# Altium project StarKit V1.0.PrjPcb
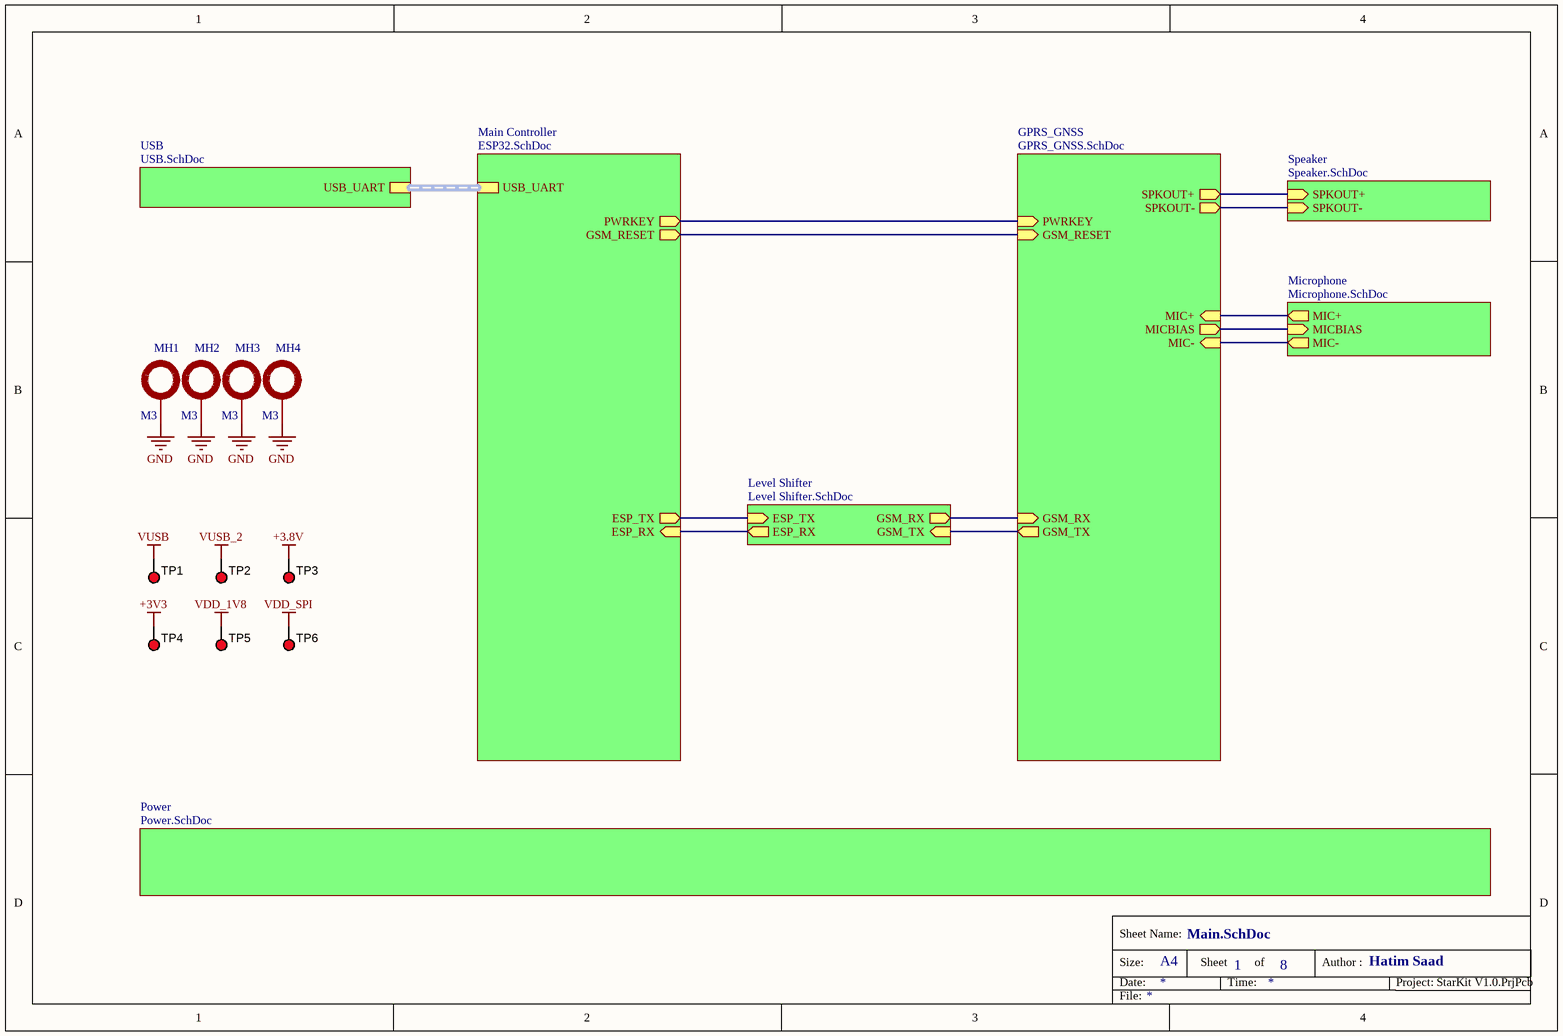
[diagram p0: Main.SchDoc]
8 sheets, 155 parts. Net scope: hierarchical (ports join the sheet entries above them; power ports are global).
Board file: StarKit PCB.PcbDoc
Sheets:
  Main.SchDoc
    Main Controller = ESP32.SchDoc
    Microphone = Microphone.SchDoc
    USB = USB.SchDoc
    GPRS_GNSS = GPRS_GNSS.SchDoc
    Speaker = Speaker.SchDoc
    Power = Power.SchDoc
    Level Shifter = Level Shifter.SchDoc

## Sheet Main.SchDoc
size A4; DocumentNumber: 1; SheetNumber: 1; SheetTotal: 8

### Parts
MH1  M3  [M3 Mounting Hole]
MH2  M3  [M3 Mounting Hole]
MH3  M3  [M3 Mounting Hole]
MH4  M3  [M3 Mounting Hole]
TP1  5010  [test point]  (value not drawn)  (no BOM)
TP2  5010  [test point]  (value not drawn)  (no BOM)
TP3  5010  [test point]  (value not drawn)  (no BOM)
TP4  5010  [test point]  (value not drawn)  (no BOM)
TP5  5010  [test point]  (value not drawn)  (no BOM)
TP6  5010  [test point]  (value not drawn)  (no BOM)

### Sub-sheets
GPRS_GNSS = GPRS_GNSS.SchDoc: PWRKEY (in), GSM_TX (out), GSM_RESET (in), GSM_RX (in), SPKOUT+ (out), SPKOUT- (out), MIC+ (in), MICBIAS (out), MIC- (in)
Level Shifter = Level Shifter.SchDoc: GSM_TX (in), ESP_TX (in), GSM_RX (out), ESP_RX (out)
Main Controller = ESP32.SchDoc: USB_UART (harness DEBUG), GSM_RESET (out), PWRKEY (out), ESP_TX (out), ESP_RX (in)
Microphone = Microphone.SchDoc: MICBIAS (in), MIC- (out), MIC+ (out)
Power = Power.SchDoc: no entries
Speaker = Speaker.SchDoc: SPKOUT+ (in), SPKOUT- (in)
USB = USB.SchDoc: USB_UART (harness DEBUG)

### Nets
+3.8V: TP3.1
+3V3: TP4.1
GND: MH1.1 MH2.1 MH3.1 MH4.1
VDD_1V8: TP5.1
VDD_SPI: TP6.1
VUSB: TP1.1
VUSB_2: TP2.1
ESP_RX: sheet Main Controller/ESP_RX, sheet Level Shifter/ESP_RX
ESP_TX: sheet Main Controller/ESP_TX, sheet Level Shifter/ESP_TX
GSM_RX: sheet GPRS_GNSS/GSM_RX, sheet Level Shifter/GSM_RX
GSM_TX: sheet GPRS_GNSS/GSM_TX, sheet Level Shifter/GSM_TX
GSMRES_1: sheet Main Controller/GSM_RESET, sheet GPRS_GNSS/GSM_RESET
MIC+: sheet Microphone/MIC+, sheet GPRS_GNSS/MIC+
MIC-: sheet Microphone/MIC-, sheet GPRS_GNSS/MIC-
MICBIAS: sheet Microphone/MICBIAS, sheet GPRS_GNSS/MICBIAS
PWRKEY_1: sheet Main Controller/PWRKEY, sheet GPRS_GNSS/PWRKEY
NetSPK_1: sheet GPRS_GNSS/SPKOUT-, sheet Speaker/SPKOUT-
NetSPK_2: sheet GPRS_GNSS/SPKOUT+, sheet Speaker/SPKOUT+

### Buses and harness runs
harness sheet Main Controller/USB_UART = sheet USB/USB_UART

### Notes on the sheet
- Size:
- Date:
- Sheet Name:
- A4
- Sheet
- Time:
- of
- Author :
- Hatim Saad
- Project:
- File:

### Library data of the parts
MH1-MH4 = Mounting Hole M3: Mounting Hole M3 Screw
TP1-TP6 = test point: Test Point, Multipurpose, Red, TH; Manufacturer: Keystone; CompType: Test Point Loop; U/M: EA; PartNumber: 5010; SymbolVersion: 2008-04-04; PackageReference: Red Multipurpose Testpoint; RoHS: Y; MountType: TH; ComponentLink1Description: Datasheet Link; ComponentLink1URL: http://www.keyelco.com/userAssets/file/M60-2p60.pdf; Value: Red; Publisher: Texas Instruments; LatestRevisionDate: 2015-08-25

## Sheet ESP32.SchDoc
size A4; DocumentNumber: 4; SheetNumber: 4; SheetTotal: 8
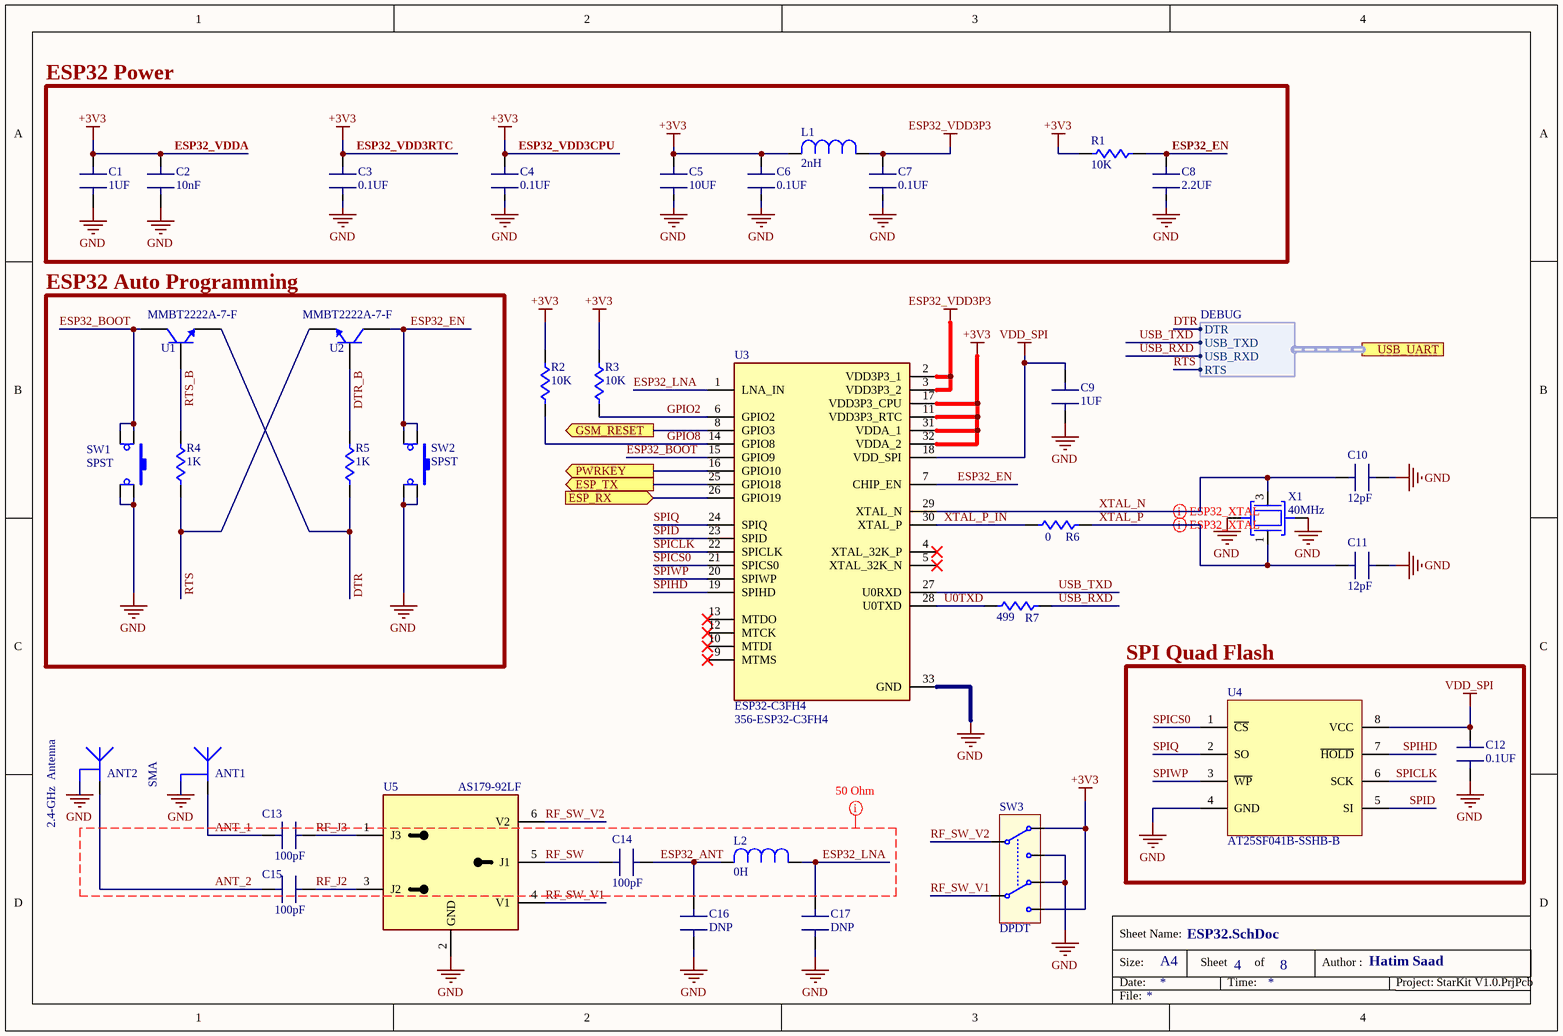
[diagram p1: ESP32.SchDoc]

### Parts
ANT1  SMA  [SMA RIGHT DIGIKEY]
ANT2  2.4-GHz  Antenna  [ANT_2.4_AN043]
C1  1UF  [CAP: 0603]
C2  10nF  [CAP: 0603]
C3  0.1UF  [CAP: 0603]
C4  0.1UF  [CAP: 0603]
C5  10UF  [CAP: 0805]
C6  0.1UF  [CAP: 0603]
C7  0.1UF  [CAP: 0603]
C8  2.2UF  [CAP: 0603]
C9  1UF  [CAP: 0603]
C10  12pF  [CAP: 0603]
C11  12pF  [CAP: 0603]
C12  0.1UF  [CAP: 0603]
C13  100pF  [CAP: 0603]
C14  100pF  [CAP: 0603]
C15  100pF  [CAP: 0603]
C16  DNP  [CAP: 0603]
C17  DNP  [CAP: 0603]
L1  2nH  [IND: 0603]
L2  0H  [IND: 0603]
R1  10K  [RES: 0603]
R2  10K  [RES: 0603]
R3  10K  [RES: 0603]
R4  1K  [RES: 0603]
R5  1K  [RES: 0603]
R6  0  [RES: 0603]
R7  499  [RES: 0603]
SW1  SPST  [Tactile Switch RKC2SJF170SMTRLFS]
SW2  SPST  [Tactile Switch RKC2SJF170SMTRLFS]
SW3  DPDT  [DPDT SWITCH]
U1  MMBT2222A-7-F  [SOT23_3]
U2  MMBT2222A-7-F  [SOT23_3]
U3  ESP32-C3FH4  Supplier Part Number 1: 356-ESP32-C3FH4  [QFN-32]
U4  AT25SF041B-SSHB-B  [8-SOIC]
U5  AS179-92LF  [SC70-6]
X1  40MHz  [4-SMD, No Lead ECS]

### Blocks framed on the sheet
ESP32 Power: C1-C8 L1 R1
ESP32 Auto Programming: R4 R5 SW1 SW2 U1 U2
SPI Quad Flash: C12 U4

### Ports
ESP_RX (in), ESP_TX (out), GSM_RESET (out), PWRKEY (out), USB_UART (harness DEBUG)

### Harnesses
DEBUG: DTR, USB_TXD, USB_RXD, RTS

### Nets
+3V3: C1.1(A) C2.1(A) C3.1(A) C4.1(A) C5.2(B) C6.1(A) L1.1 R1.1 R2.2 R3.2 SW3.1(B1) SW3.6(B2) U3.11(VDD3P3_RTC) U3.17(VDD3P3_CPU) U3.31(VDDA_1) U3.32(VDDA_2)
ESP32_VDD3P3: C7.1(A) L1.2 U3.2(VDD3P3_1) U3.3(VDD3P3_2)
GND: ANT1.2 ANT2.2 C1.2(B) C2.2(B) C3.2(B) C4.2(B) C5.1(A) C6.2(B) C7.2(B) C8.2(B) C9.2(B) C10.1(A) C11.1(A) C12.2(B) C16.2(B) C17.2(B) SW1.3 SW1.4 SW2.3 SW2.4 SW3.3(A1) SW3.4(A2) U3.33(GND) U4.4(GND) U5.2(GND) X1.2(GND) X1.4(GND)
VDD_SPI: C9.1(A) C12.1(A) U3.18(VDD_SPI) U4.8(VCC)
ANT_1: ANT1.1 C13.2(B)
ANT_2: ANT2.1 C15.2(B)
DTR: R5.2 U1.2(E) ; port USB_UART.DTR
DTR_B: R5.1 U2.1(B)
ESP32_ANT: C14.1(A) C16.1(A) L2.1
ESP32_BOOT: SW1.1 SW1.2 U1.3(C) U3.15(GPIO9)
ESP32_EN: C8.1(A) R1.2 SW2.1 SW2.2 U2.3(C) U3.7(CHIP_EN)
ESP32_LNA: C17.1(A) L2.2 U3.1(LNA_IN)
ESP_RX: U3.26(GPIO19) ; port ESP_RX
ESP_TX: U3.25(GPIO18) ; port ESP_TX
GPIO2: R3.1 U3.6(GPIO2)
GPIO8: R2.1 U3.14(GPIO8)
GSMRES_1: U3.8(GPIO3) ; port GSM_RESET
PWRKEY_1: U3.16(GPIO10) ; port PWRKEY
RF_J2: C15.1(A) U5.3(J2)
RF_J3: C13.1(A) U5.1(J3)
RF_SW: C14.2(B) U5.5(J1)
RF_SW_V1: SW3.5(COM2) U5.4(V1)
RF_SW_V2: SW3.2(COM1) U5.6(V2)
RTS: R4.2 U2.2(E) ; port USB_UART.RTS
RTS_B: R4.1 U1.1(B)
SPICLK: U3.22(SPICLK) U4.6(SCK)
SPICS0: U3.21(SPICS0) U4.1(~{CS})
SPID: U3.23(SPID) U4.5(SI)
SPIHD: U3.19(SPIHD) U4.7(~{HOLD})
SPIQ: U3.24(SPIQ) U4.2(SO)
SPIWP: U3.20(SPIWP) U4.3(~{WP})
U0TXD: R7.1 U3.28(U0TXD)
USB_RXD: R7.2 ; port USB_UART.USB_RXD
USB_TXD: U3.27(U0RXD) ; port USB_UART.USB_TXD
XTAL_N: C10.2(B) U3.29(XTAL_N) X1.3
XTAL_P: C11.2(B) R6.2 X1.1
XTAL_P_IN: R6.1 U3.30(XTAL_P)

Not connected (* = marked no-connect by the designer): U3 4(XTAL_32K_P)* 5(XTAL_32K_N)* 9(MTMS)* 10(MTDI)* 12(MTCK)* 13(MTDO)*

### Layout directives
differential pair: XTAL_N, XTAL_P
net class ANT: ANT_1, ANT_2, ESP32_ANT, ESP32_LNA, RF_J2, RF_J3, RF_SW

### Notes on the sheet
- (near C2) ESP32_VDDA
- (near C3) ESP32_VDD3RTC
- (near C4) ESP32_VDD3CPU
- Size:
- Date:
- Sheet Name:
- A4
- Sheet
- Time:
- of
- Author :
- Hatim Saad
- Project:
- File:

### Library data of the parts
ANT1 = SMA_1: Right Angled Female SMA Connector
ANT2 = ANT_2.4_AN043: Frequency 2.4 GHz             Typical Efficiency 68%               Bandwidth@ VSWR 2:0 101 MHz            Dimensions (mm) 15 x 8
C1-C4 C6-C17 = CAP 0603: CAP SMD 0603
C5 = CAP 0805: CAP SMD 0805
L1 L2 = IND 0603: IND SMD 0603
R1-R7 = RES 0603: RES SMD 0603
SW1 SW2 = RKC2SJF170SMTRLFS: Switch Tactile OFF-MOM SPST-NO Button J-Lead 12VDC 100000Cycles 500gf SMD T/R; Manufacturer: ITT C&K; Supplier 1: Mouser; Manufacturer Part Number: RKC2SJF170SMTRLFS; RoHS: No; Category: Tactile Switches; Stock 1: 16876; Pricing 1: 1=0.29, 10=0.285, 50=0.285, 100=0.246, 1000=0.177, 10000=0.152 (USD); Supplier Part Number 1: 611-RKC2SJF170SMRLFS
SW3 = MST22D18G2 125: Swicth DPDT 0.1A 12V 10000 SMD Slide Switches
U1 U2 = MMBT2222A-7-F: MMBT2222 Series NPN 350 mW 40 V 600 mA SMT Small Signal Transistor - SOT-23; Manufacturer: Diodes; hFE Min: 100; Frequency: 300MHz; Max Power Dissipation: 300mW; Number of Elements: 1; Collector Emitter Voltage (VCEO): 40V; Collector Base Voltage (VCBO): 75V; Emitter Base Voltage (VEBO): 6V; Collector Emitter Saturation Voltage: 1V; Max Collector Current: 600mA; Power Dissipation: 350mW; Current: 1A; Supplier 1: Mouser; Manufacturer Part Number: MMBT2222A-7-F; RoHS: Yes; Category: BJTs; Stock 1: 1332144; Pricing 1: 1=0.14, 10=0.097, 50=0.097, 100=0.041, 1000=0.028, 10000=0.016 (USD); Mount: Surface Mount; Case/Package: SOT-23; Number of Pins: 3; Weight: 0.000282oz; Min Operating Temperature: -55°C; Max Operating Temperature: 150°C; Polarity: NPN; Packaging: Tape and Reel; Package Quantity: 3000; Continuous Collector Current: 600mA; Collector Emitter Breakdown Voltage: 40V; Transition Frequency: 300MHz; Max Breakdown Voltage: 40V; Max Frequency: 300MHz; Termination: SMD/SMT; Gain Bandwidth Product: 300MHz; Voltage Rating (DC): 40V; Current Rating: 600mA; Voltage: 40V; Collector-emitter Voltage-Max: 1V; Series: Automotive, AEC-Q101; Length: 3.05mm; Width: 1.4mm; Height: 1mm; Radiation Hardening: No; Reach SVHC Compliant: No; Lead Free: Lead Free; RoHS Compliant: Yes; ComponentLink1URL: https://datasheet.ciiva.com/15139/getdatasheetpartid-82692-15139078.pdf?src-supplier=Verical; ComponentLink1Description: https://datasheet.ciiva.com/15139/getdatasheetpartid-82692-15139078.pdf?src-supplier=Verical; ComponentLink2URL: https://datasheet.ciiva.com/8029/ds30041-8029709.pdf?src-supplier=Element14; ComponentLink2Description: https://datasheet.ciiva.com/8029/ds30041-8029709.pdf?src-supplier=Element14; ComponentLink3URL: https://datasheet.ciiva.com/11201/ds30041-11201864.pdf?src-supplier=Avnet; ComponentLink3Description: https://datasheet.ciiva.com/11201/ds30041-11201864.pdf?src-supplier=Avnet; ComponentLink4URL: https://datasheet.ciiva.com/16199/ds30041-16199045.pdf?src-supplier=Future+Electronics; ComponentLink4Description: https://datasheet.ciiva.com/16199/ds30041-16199045.pdf?src-supplier=Future+Electronics; ComponentLink5URL: https://datasheet.ciiva.com/11198/ds30041-11198965.pdf?src-supplier=Avnet; ComponentLink5Description: https://datasheet.ciiva.com/11198/ds30041-11198965.pdf?src-supplier=Avnet; ComponentLink6URL: https://datasheet.ciiva.com/972/ds30041-972551.pdf?src-supplier=Digi-Key; ComponentLink6Description: https://datasheet.ciiva.com/972/ds30041-972551.pdf?src-supplier=Digi-Key; ComponentLink7URL: https://datasheet.ciiva.com/972/ds30041-972552.pdf?src-supplier=Digi-Key; ComponentLink7Description: https://datasheet.ciiva.com/972/ds30041-972552.pdf?src-supplier=Digi-Key; ComponentLink8URL: https://datasheet.ciiva.com/972/ds30041-972550.pdf?src-supplier=Digi-Key; ComponentLink8Description: https://datasheet.ciiva.com/972/ds30041-972550.pdf?src-supplier=Digi-Key; Supplier Part Number 1: 621-MMBT2222A-F
U3 = ESP32-C3FH4: SoC 32-Bit RISC 160MHz Single Core 4MB 32-Pin QFN T/R; Manufacturer: Espressif Systems; Supplier 1: Mouser; Manufacturer Part Number: ESP32-C3FH4; RoHS: No; Stock 1: 6949; Pricing 1: 1=1.3, 10=1.3, 50=1.3, 100=1.3, 1000=1.3, 10000=1.3 (USD)
U4 = AT25SF041B-SSHB-B: NOR Flash Serial (SPI, Dual SPI, Quad SPI) 3.3V 4M-bit 512K x 8 7ns Tube; Manufacturer: Renesas; Supplier: Mouser; Supplier Part Number: 988-AT25SF041-SSH-B; Manufacturer Part Number: AT25SF041B-SSHB-B; RoHS: No; Category: Memory; Stock: 14517; Pricing: 1=0.42, 10=0.38, 50=0.38, 100=0.333, 1000=0.326, 10000=0.287 (USD); Supplier 1: Mouser; Supplier Part Number 1: 988-AT25SF041-SSH-B
U5 = AS179-92LF: RF Switch SPDT 0.02MHz to 4GHz 20dB Automotive 6-Pin SC-88 T/R / IC SW SPDT DC-3GHZ GAAS SC70-6; Manufacturer: Skyworks Solutions; Supplier: Mouser; Supplier Part Number: 873-AS179-92LF; Manufacturer Part Number: AS179-92LF; RoHS: Yes; Category: Integrated Circuits (ICs); Stock: 56001; Pricing: 1=1.19, 10=1.02, 50=1.02, 100=0.778, 1000=0.543, 10000=0.462 (USD); ComponentLink1URL: https://datasheet.ciiva.com/12080/200176g-18773-12080182.pdf?src-supplier=Mouser; ComponentLink1Description: https://datasheet.ciiva.com/12080/200176g-18773-12080182.pdf?src-supplier=Mouser; ComponentLink2URL: https://datasheet.ciiva.com/15100/getdatasheetpartid-658205-15100462.pdf?src-supplier=Verical; ComponentLink2Description: https://datasheet.ciiva.com/15100/getdatasheetpartid-658205-15100462.pdf?src-supplier=Verical; ComponentLink3URL: https://datasheet.ciiva.com/22694/1909043-22694026.pdf?src-supplier=Element14; ComponentLink3Description: https://datasheet.ciiva.com/22694/1909043-22694026.pdf?src-supplier=Element14; ComponentLink4URL: https://datasheet.ciiva.com/2799/200176g-2799448.pdf?src-supplier=Digi-Key; ComponentLink4Description: https://datasheet.ciiva.com/2799/200176g-2799448.pdf?src-supplier=Digi-Key; ComponentLink5URL: https://datasheet.ciiva.com/2799/200176g-2799449.pdf?src-supplier=Digi-Key; ComponentLink5Description: https://datasheet.ciiva.com/2799/200176g-2799449.pdf?src-supplier=Digi-Key; ComponentLink6URL: https://datasheet.ciiva.com/2799/200176g-2799450.pdf?src-supplier=Digi-Key; ComponentLink6Description: https://datasheet.ciiva.com/2799/200176g-2799450.pdf?src-supplier=Digi-Key; Supplier 1: Mouser; Supplier Part Number 1: 873-AS179-92LF
X1 = ECS-400-10-37B2-CKY-TR: Crystal 40MHz 10pF 4-Pin SMD ECX-1637B2 T/R; Manufacturer: ECS International; Supplier 1: Mouser; Manufacturer Part Number: ECS-400-10-37B2-CKY-TR; RoHS: No; Category: Uncategorized; Stock 1: 5766; Pricing 1: 1=0.38, 10=0.285, 50=0.285, 100=0.253, 1000=0.203, 10000=0.176 (USD); Supplier Part Number 1: 520-400-10-37B2CKYTR

## Sheet Microphone.SchDoc
size A4; DocumentNumber: 8; SheetNumber: 8; SheetTotal: 8
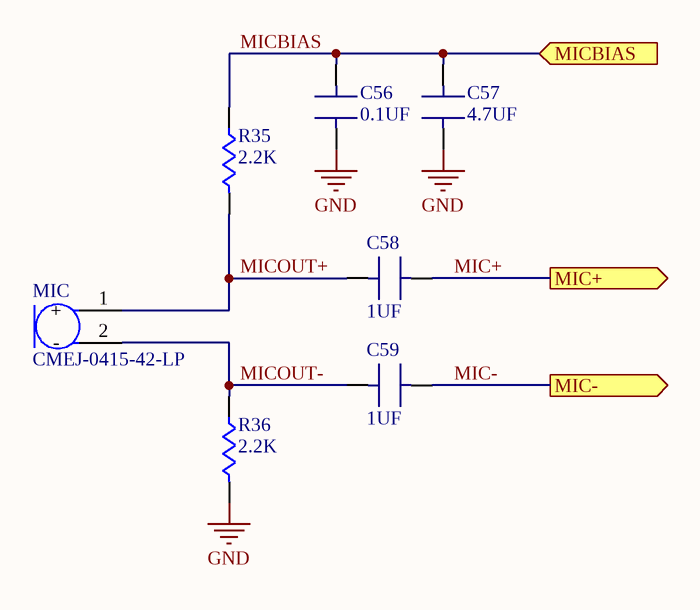
[diagram p2: Microphone.SchDoc]

### Parts
C56  0.1UF  [CAP: 0603]
C57  4.7UF  [CAP: 0805]
C58  1UF  [CAP: 0603]
C59  1UF  [CAP: 0603]
MIC  CMEJ-0415-42-LP  [CMEJ041542LP]
R35  2.2K  [RES: 0603]
R36  2.2K  [RES: 0603]

### Ports
MIC+ (out), MIC- (out), MICBIAS (in)

### Nets
GND: C56.2(B) C57.1(A) R36.1
MIC+: C58.2(B) ; port MIC+
MIC-: C59.2(B) ; port MIC-
MICBIAS: C56.1(A) C57.2(B) R35.2 ; port MICBIAS
MICOUT+: C58.1(A) MIC.1(+) R35.1
MICOUT-: C59.1(A) MIC.2(-) R36.2

### Notes on the sheet
- Size:
- Date:
- Sheet Name:
- A4
- Sheet
- Time:
- of
- Author :
- Hatim Saad
- Project:
- File:

### Library data of the parts
C56 C58 C59 = CAP 0603: CAP SMD 0603
C57 = CAP 0805: CAP SMD 0805
MIC = CMEJ-0415-42-LP: 4.0 mm, Omnidirectional, PCB Mount, 2.0 Vdc, Elecret Condenser Microphone; Manufacturer: CUI Devices; Supplier 1: Mouser; Manufacturer Part Number: CMEJ-0415-42-LP; RoHS: No; Category: Microphones; Stock 1: 3285; Pricing 1: 1=0.43, 10=0.367, 50=0.367, 100=0.308, 1000=0.254, 10000=0.209 (USD); ComponentLink1URL: https://www.cuidevices.com/product/resource/digikeypdf/cmej-0415-42-lp.pdf?src-supplier=Digi-Key; ComponentLink1Description: https://www.cuidevices.com/product/resource/digikeypdf/cmej-0415-42-lp.pdf?src-supplier=Digi-Key; Supplier Part Number 1: 490-CMEJ-0415-42-LP
R35 R36 = RES 0603: RES SMD 0603

## Sheet USB.SchDoc
size A4; DocumentNumber: 3; SheetNumber: 3; SheetTotal: 8
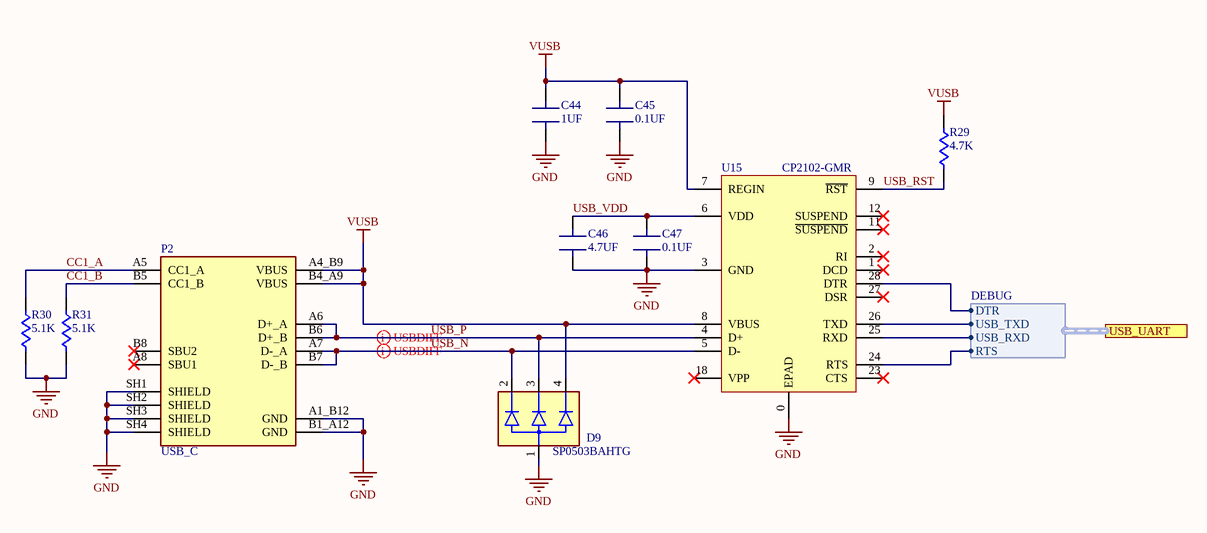
[diagram p3: USB.SchDoc]

### Parts
C44  1UF  [CAP: 0603]
C45  0.1UF  [CAP: 0603]
C46  4.7UF  [CAP: 0805]
C47  0.1UF  [CAP: 0603]
D9  SP0503BAHTG  [SOT143-4]
P2  USB_C  [AMPHENOL_12402012E212A]
R29  4.7K  [RES: 0603]
R30  5.1K  [RES: 0603]
R31  5.1K  [RES: 0603]
U15  CP2102-GMR  [28-QFN (5x5)]

### Ports
USB_UART (harness DEBUG)

### Harnesses
DEBUG: DTR, USB_TXD, USB_RXD, RTS

### Nets
GND: C44.1(A) C45.1(A) C46.1(A) C47.1(A) D9.1 P2.A1_B12(GND) P2.B1_A12(GND) P2.SH1(SHIELD) P2.SH2(SHIELD) P2.SH3(SHIELD) P2.SH4(SHIELD) R30.1 R31.1 U15.0(EPAD) U15.3(GND)
VUSB: C44.2(B) C45.2(B) D9.4 P2.A4_B9(VBUS) P2.B4_A9(VBUS) R29.2 U15.7(REGIN) U15.8(VBUS)
CC1_A: P2.A5(CC1_A) R30.2
CC1_B: P2.B5(CC1_B) R31.2
DTR: U15.28(DTR) ; port USB_UART.DTR
RTS: U15.24(RTS) ; port USB_UART.RTS
USB_N: D9.2 P2.A7(D-_A) P2.B7(D-_B) U15.5(D-)
USB_P: D9.3 P2.A6(D+_A) P2.B6(D+_B) U15.4(D+)
USB_RST: R29.1 U15.9(~{RST})
USB_RXD: U15.25(RXD) ; port USB_UART.USB_RXD
USB_TXD: U15.26(TXD) ; port USB_UART.USB_TXD
USB_VDD: C46.2(B) C47.2(B) U15.6(VDD)

Not connected (* = marked no-connect by the designer): P2 A8(SBU1)* B8(SBU2)*; U15 1(DCD)* 2(RI)* 11(~{SUSPEND})* 12(SUSPEND)* 18(VPP)* 23(CTS)* 27(DSR)*

### Layout directives
differential pair; net class USBDIFF: USB_N, USB_P

### Notes on the sheet
- Size:
- Date:
- Sheet Name:
- A4
- Sheet
- Time:
- of
- Author :
- Hatim Saad
- Project:
- File:

### Library data of the parts
C44 C45 C47 = CAP 0603: CAP SMD 0603
C46 = CAP 0805: CAP SMD 0805
D9 = SP0503BAHTG: SP050xBA Series 8.5 V 30 pF Triple Uni-Directional TVS Avalanche Diode-SOT143-4; Manufacturer: Littelfuse; Operating Supply Voltage: 5.5V; Direction: Unidirectional; Value: 30pF; Number of Channels: 3; Clamping Voltage: 7.8V; Power Line Protection: No; Polarity: Bidirectional,Unidirectional; Max Power Dissipation: 225mW; ESD Protection: Yes; Max Reverse Leakage Current: 100nA; Voltage Rating (DC): 5V; Clamping Voltage-Max: 8V; Supplier: Future Electronics; Supplier Part Number: 4171229; Manufacturer Part Number: SP0503BAHTG; RoHS: Yes; Category: TVS Diodes; Stock: 3237; Pricing: 1=0.85, 15=0.75, 75=0.69, 300=0.64, 1500=0.585 (USD); Mounting Technology: Surface Mount; Case/Package: SOT-143; Pins: 4; Min Operating Temperature: -40°C; Max Operating Temperature: 85°C; Packaging: Tape and Reel; Number of Unidirectional Channels: 3; Reverse Standoff Voltage: 5.5V; Breakdown Voltage: 5.5V; Termination: SMD/SMT; Working Voltage: 5.5V; Peak Pulse Power: 225mW; Leakage Current: 100nA; Number of Elements: 3; Power Dissipation: 225mW; Diode Type: Avalanche; Series: SP05, SPA®; Length: 3.04mm; Width: 1.4mm; Height: 1.05mm; Depth: 1.4mm; Radiation Hardening: No; Reach SVHC Compliant: No; Lead Free: Lead Free; RoHS Compliant: Yes; ComponentLink1URL: https://datasheet.ciiva.com/15143/getdatasheetpartid-116020-15143550.pdf?src-supplier=Verical; ComponentLink1Description: https://datasheet.ciiva.com/15143/getdatasheetpartid-116020-15143550.pdf?src-supplier=Verical; ComponentLink2URL: https://datasheet.ciiva.com/7650/526672-7650894.pdf?src-supplier=Element14; ComponentLink2Description: https://datasheet.ciiva.com/7650/526672-7650894.pdf?src-supplier=Element14; ComponentLink3URL: https://datasheet.ciiva.com/8062/littefuse-spa-sp050x-8062422.pdf?src-supplier=Element14; ComponentLink3Description: https://datasheet.ciiva.com/8062/littefuse-spa-sp050x-8062422.pdf?src-supplier=Element14; ComponentLink4URL: https://datasheet.ciiva.com/22697/1911798-22697942.pdf?src-supplier=Element14; ComponentLink4Description: https://datasheet.ciiva.com/22697/1911798-22697942.pdf?src-supplier=Element14; ComponentLink5URL: https://datasheet.ciiva.com/4509/sp05x-leadfree-4509162.pdf?src-supplier=Mouser; ComponentLink5Description: https://datasheet.ciiva.com/4509/sp05x-leadfree-4509162.pdf?src-supplier=Mouser; ComponentLink6URL: https://datasheet.ciiva.com/332/sp05xxba-332551.pdf?src-supplier=Digi-Key; ComponentLink6Description: https://datasheet.ciiva.com/332/sp05xxba-332551.pdf?src-supplier=Digi-Key; ComponentLink7URL: https://datasheet.ciiva.com/332/sp05xxba-332552.pdf?src-supplier=Digi-Key; ComponentLink7Description: https://datasheet.ciiva.com/332/sp05xxba-332552.pdf?src-supplier=Digi-Key; ComponentLink8URL: https://datasheet.ciiva.com/332/sp05xxba-332550.pdf?src-supplier=Digi-Key; ComponentLink8Description: https://datasheet.ciiva.com/332/sp05xxba-332550.pdf?src-supplier=Digi-Key; ComponentLink9URL: https://datasheet.ciiva.com/16449/sp05xxba-16449463.pdf?src-supplier=Future+Electronics; ComponentLink9Description: https://datasheet.ciiva.com/16449/sp05xxba-16449463.pdf?src-supplier=Future+Electronics; Supplier 1: Mouser; Supplier Part Number 1: 576-SP0503BAHTG
P2 = 12402012E212A: USB Connectors USB2.0, Type C, Top mount, CH 1.68mm, Dual Row SMT; Manufacturer: Amphenol; Supplier: Mouser; Supplier Part Number: 523-12402012E212A; Manufacturer Part Number: 12402012E212A; RoHS: No; Category: Connectors; Stock: 14661; Pricing: 1=0.66, 10=0.523, 50=0.502, 100=0.46, 1000=0.345, 10000=0.293 (USD); Supplier 1: Mouser; Supplier Part Number 1: 523-12402012E212A
R29-R31 = RES 0603: RES SMD 0603
U15 = CP2102-GMR: Interface IC low speed/full speed USB to UART bridge USB 2.0 3.3V, CP2102-GMR, VFQFN-28; Manufacturer: Silicon Labs; Number of Channels: 1; Data Rate: 1000Kbps; Max Supply Voltage: 3.6V; Min Supply Voltage: 3V; Operating Supply Current: 20mA; Supply Current: 26mA; Supplier 1: Mouser; Manufacturer Part Number: CP2102-GMR; RoHS: Yes; Category: Interface ICs; Stock 1: 44709; Pricing 1: 1=9.23, 10=8.41, 50=7.82, 100=6.93, 1000=5.28, 10000=5.16 (USD); Mount: Surface Mount; Case/Package: QFN; Number of Pins: 28; Weight: 0.00239oz; Contact Plating: Tin; Min Operating Temperature: -40°C; Max Operating Temperature: 85°C; Packaging: Tape and Reel; Package Quantity: 1500; Interface: UART; Series: -; Radiation Hardening: No; Lead Free: Lead Free; RoHS Compliant: Yes; ComponentLink1URL: https://datasheet.ciiva.com/6636/cp2102-9-6636566.pdf?src-supplier=Digi-Key; ComponentLink1Description: https://datasheet.ciiva.com/6636/cp2102-9-6636566.pdf?src-supplier=Digi-Key; ComponentLink2URL: https://datasheet.ciiva.com/6636/cp2102-9-6636571.pdf?src-supplier=Digi-Key; ComponentLink2Description: https://datasheet.ciiva.com/6636/cp2102-9-6636571.pdf?src-supplier=Digi-Key; Supplier Part Number 1: 634-CP2102-GMR

## Sheet GPRS_GNSS.SchDoc
size A3
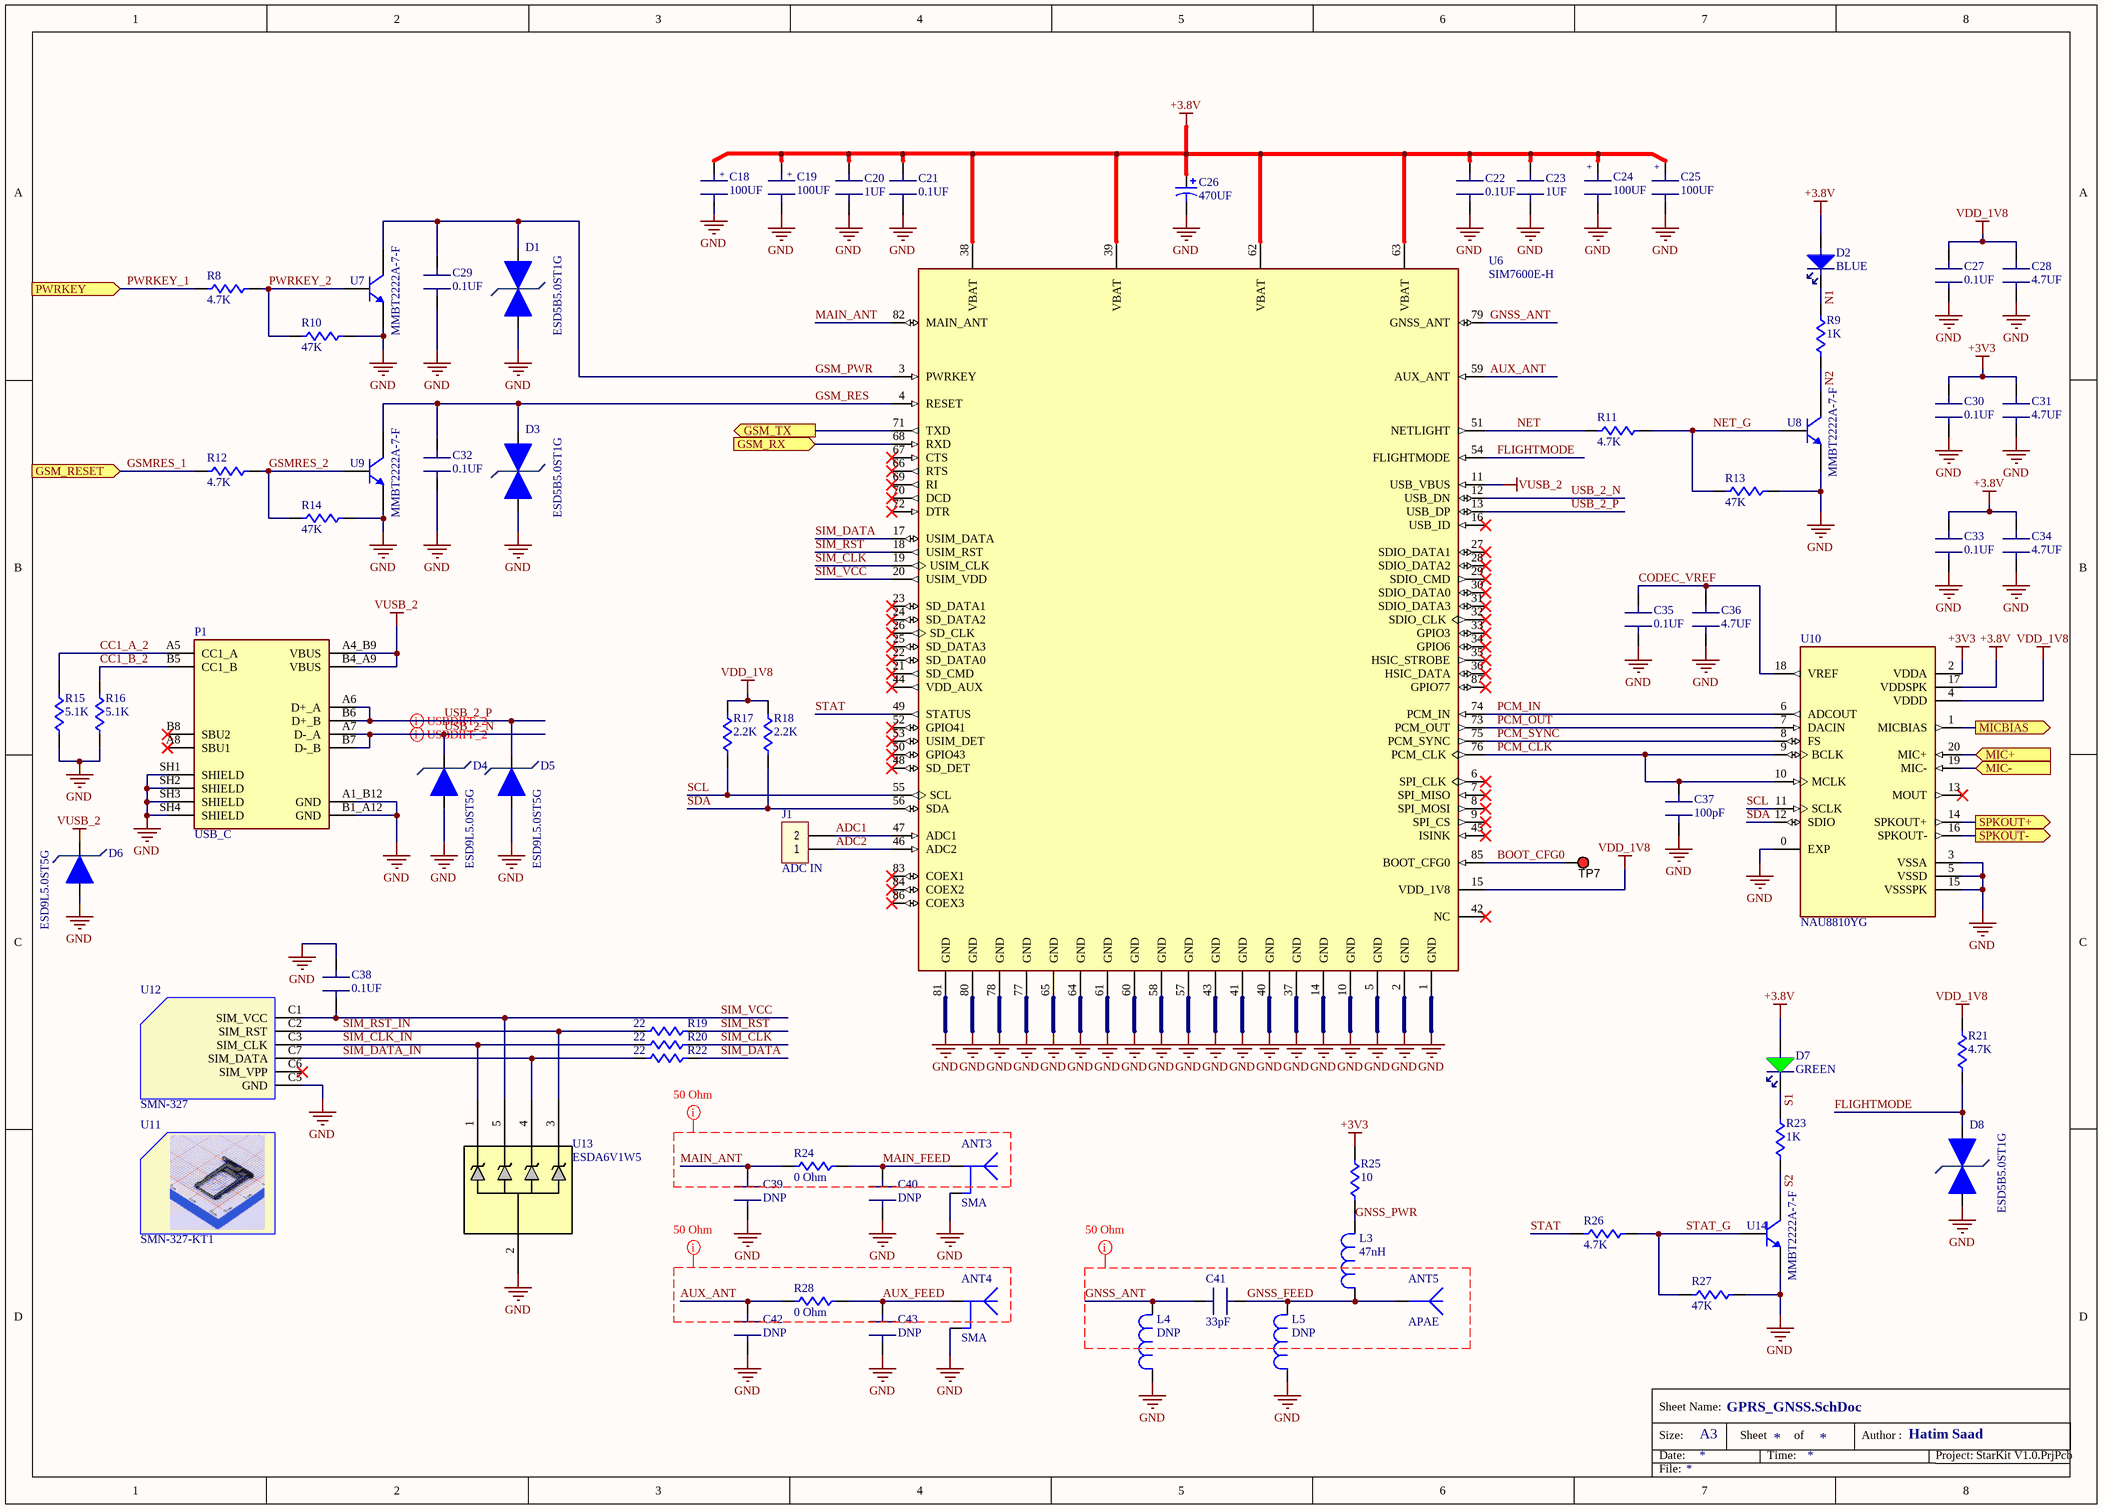
[diagram p4: GPRS_GNSS.SchDoc]

### Parts
ANT3  SMA  [SMA RIGHT DIGIKEY]
ANT4  SMA  [SMA RIGHT DIGIKEY]
ANT5  APAE  [Ceramic Patch Antenna 25x25]
C18  100UF  [CAP: TANTAL-D]
C19  100UF  [CAP: TANTAL-D]
C20  1UF  [CAP: 0603]
C21  0.1UF  [CAP: 0603]
C22  0.1UF  [CAP: 0603]
C23  1UF  [CAP: 0603]
C24  100UF  [CAP: TANTAL-D]
C25  100UF  [CAP: TANTAL-D]
C26  470UF  [CAP POLY: 7.3X4.3X2.8]
C27  0.1UF  [CAP: 0603]
C28  4.7UF  [CAP: 0805]
C29  0.1UF  [CAP: 0603]
C30  0.1UF  [CAP: 0603]
C31  4.7UF  [CAP: 0805]
C32  0.1UF  [CAP: 0603]
C33  0.1UF  [CAP: 0603]
C34  4.7UF  [CAP: 0805]
C35  0.1UF  [CAP: 0603]
C36  4.7UF  [CAP: 0805]
C37  100pF  [CAP: 0603]
C38  0.1UF  [CAP: 0603]
C39  DNP  [CAP: 0603]
C40  DNP  [CAP: 0603]
C41  33pF  [CAP: 0603]
C42  DNP  [CAP: 0603]
C43  DNP  [CAP: 0603]
D1  ESD5B5.0ST1G  [SOD-523-2]
D2  BLUE  [LED: 0603B]
D3  ESD5B5.0ST1G  [SOD-523-2]
D4  ESD9L5.0ST5G  [SOD-923-2]
D5  ESD9L5.0ST5G  [SOD-923-2]
D6  ESD9L5.0ST5G  [SOD-923-2]
D7  GREEN  [LED: 0603G]
D8  ESD5B5.0ST1G  [SOD-523-2]
J1  ADC IN  [CON: PLS-2]
L3  47nH  [IND: 0603]
L4  DNP  [IND: 0603]
L5  DNP  [IND: 0603]
P1  USB_C  [AMPHENOL_12402012E212A]
R8  4.7K  [RES: 0603]
R9  1K  [RES: 0603]
R10  47K  [RES: 0603]
R11  4.7K  [RES: 0603]
R12  4.7K  [RES: 0603]
R13  47K  [RES: 0603]
R14  47K  [RES: 0603]
R15  5.1K  [RES: 0603]
R16  5.1K  [RES: 0603]
R17  2.2K  [RES: 0603]
R18  2.2K  [RES: 0603]
R19  22  [RES: 0603]
R20  22  [RES: 0603]
R21  4.7K  [RES: 0603]
R22  22  [RES: 0603]
R23  1K  [RES: 0603]
R24  0 Ohm  [RES: 0603]
R25  10  [RES: 0603]
R26  4.7K  [RES: 0603]
R27  47K  [RES: 0603]
R28  0 Ohm  [RES: 0603]
TP7  5010  [test point]  (value not drawn)  (no BOM)
U6  SIM7600E-H  [SIM7600X]
U7  MMBT2222A-7-F  [SOT23_3]
U8  MMBT2222A-7-F  [SOT23_3]
U9  MMBT2222A-7-F  [SOT23_3]
U10  NAU8810YG  [20-QFN (4x4)]
U11  SMN-327-KT1  (mechanical)
U12  SMN-327  [SIM_NANO_SMN-327]
U13  ESDA6V1W5  [SOT323-5L]
U14  MMBT2222A-7-F  [SOT23_3]

### Ports
GSM_RESET (in), GSM_RX (in), GSM_TX (out), MIC+ (in), MIC- (in), MICBIAS (out), PWRKEY (in), SPKOUT+ (out), SPKOUT- (out)

### Nets
+3.8V: C18.1(+) C19.1(+) C20.1(A) C21.1(A) C22.1(A) C23.1(A) C24.1(+) C25.1(+) C26.1 C33.1(A) C34.2(B) D2.2(A) D7.2(A) U6.38(VBAT) U6.39(VBAT) U6.62(VBAT) U6.63(VBAT) U10.17(VDDSPK)
+3V3: C30.1(A) C31.2(B) R25.2 U10.2(VDDA)
GND: ANT3.2 ANT4.2 C18.2(-) C19.2(-) C20.2(B) C21.2(B) C22.2(B) C23.2(B) C24.2(-) C25.2(-) C26.2 C27.2(B) C28.1(A) C29.2(B) C30.2(B) C31.1(A) C32.2(B) C33.2(B) C34.1(A) C35.2(B) C36.1(A) C37.2(B) C38.1(A) C39.2(B) C40.2(B) C42.2(B) C43.2(B) D1.2 D3.2 D4.2 D5.2 D6.2 D8.2 L4.1 L5.1 P1.A1_B12(GND) P1.B1_A12(GND) P1.SH1(SHIELD) P1.SH2(SHIELD) P1.SH3(SHIELD) P1.SH4(SHIELD) R10.2 R13.2 R14.2 R15.1 R16.1 R27.2 U6.1(GND) U6.2(GND) U6.5(GND) U6.10(GND) U6.14(GND) U6.37(GND) U6.40(GND) U6.41(GND) U6.43(GND) U6.57(GND) U6.58(GND) U6.60(GND) U6.61(GND) U6.64(GND) U6.65(GND) U6.77(GND) U6.78(GND) U6.80(GND) U6.81(GND) U7.2(E) U8.2(E) U9.2(E) U10.0(EXP) U10.3(VSSA) U10.5(VSSD) U10.15(VSSSPK) U12.C5(GND) U13.2 U14.2(E)
VDD_1V8: C27.1(A) C28.2(B) R17.2 R18.2 R21.2 U6.15(VDD_1V8) U10.4(VDDD)
VUSB_2: D6.1 P1.A4_B9(VBUS) P1.B4_A9(VBUS) U6.11(USB_VBUS)
ADC1: J1.2 U6.47(ADC1)
ADC2: J1.1 U6.46(ADC2)
AUX_ANT: C42.1(A) R28.1 U6.59(AUX_ANT)
AUX_FEED: ANT4.1 C43.1(A) R28.2
BOOT_CFG0: TP7.1 U6.85(BOOT_CFG0)
CC1_A_2: P1.A5(CC1_A) R15.2
CC1_B_2: P1.B5(CC1_B) R16.2
CODEC_VREF: C35.1(A) C36.2(B) U10.18(VREF)
FLIGHTMODE: D8.1 R21.1 U6.54(FLIGHTMODE)
GNSS_ANT: C41.1(A) L4.2 U6.79(GNSS_ANT)
GNSS_FEED: ANT5.1 C41.2(B) L3.1 L5.2
GNSS_PWR: L3.2 R25.1
GSM_PWR: C29.1(A) D1.1 U6.3(PWRKEY) U7.3(C)
GSM_RES: C32.1(A) D3.1 U6.4(RESET) U9.3(C)
GSM_RX: U6.68(RXD) ; port GSM_RX
GSM_TX: U6.71(TXD) ; port GSM_TX
GSMRES_1: R12.1 ; port GSM_RESET
GSMRES_2: R12.2 R14.1 U9.1(B)
MAIN_ANT: C39.1(A) R24.1 U6.82(MAIN_ANT)
MAIN_FEED: ANT3.1 C40.1(A) R24.2
MIC+: U10.20(MIC+) ; port MIC+
MIC-: U10.19(MIC-) ; port MIC-
MICBIAS: U10.1(MICBIAS) ; port MICBIAS
N1: D2.1(C) R9.2
N2: R9.1 U8.3(C)
NET: R11.1 U6.51(NETLIGHT)
NET_G: R11.2 R13.1 U8.1(B)
PCM_CLK: C37.1(A) U6.76(PCM_CLK) U10.9(BCLK) U10.10(MCLK)
PCM_IN: U6.74(PCM_IN) U10.6(ADCOUT)
PCM_OUT: U6.73(PCM_OUT) U10.7(DACIN)
PCM_SYNC: U6.75(PCM_SYNC) U10.8(FS)
PWRKEY_1: R8.1 ; port PWRKEY
PWRKEY_2: R8.2 R10.1 U7.1(B)
S1: D7.1(C) R23.2
S2: R23.1 U14.3(C)
SCL: R17.1 U6.55(SCL) U10.11(SCLK)
SDA: R18.1 U6.56(SDA) U10.12(SDIO)
SIM_CLK: R20.2 U6.19(USIM_CLK)
SIM_CLK_IN: R20.1 U12.C3(SIM_CLK) U13.1
SIM_DATA: R22.2 U6.17(USIM_DATA)
SIM_DATA_IN: R22.1 U12.C7(SIM_DATA) U13.4
SIM_RST: R19.2 U6.18(USIM_RST)
SIM_RST_IN: R19.1 U12.C2(SIM_RST) U13.3
SIM_VCC: C38.2(B) U6.20(USIM_VDD) U12.C1(SIM_VCC) U13.5
STAT: R26.1 U6.49(STATUS)
STAT_G: R26.2 R27.1 U14.1(B)
USB_2_N: D4.1 P1.A7(D-_A) P1.B7(D-_B) U6.12(USB_DN)
USB_2_P: D5.1 P1.A6(D+_A) P1.B6(D+_B) U6.13(USB_DP)
NetSPK_1: U10.16(SPKOUT-) ; port SPKOUT-
NetSPK_2: U10.14(SPKOUT+) ; port SPKOUT+

Not connected (* = marked no-connect by the designer): P1 A8(SBU1)* B8(SBU2)*; U6 6(SPI_CLK)* 7(SPI_MISO)* 8(SPI_MOSI)* 9(SPI_CS)* 16(USB_ID)* 21(SD_CMD)* 22(SD_DATA0)* 23(SD_DATA1)* 24(SD_DATA2)* 25(SD_DATA3)* 26(SD_CLK)* 27(SDIO_DATA1)* 28(SDIO_DATA2)* 29(SDIO_CMD)* 30(SDIO_DATA0)* 31(SDIO_DATA3)* 32(SDIO_CLK)* 33(GPIO3)* 34(GPIO6)* 35(HSIC_STROBE)* 36(HSIC_DATA)* 42(NC)* 44(VDD_AUX)* 45(ISINK)* 48(SD_DET)* 50(GPIO43)* 52(GPIO41)* 53(USIM_DET)* 66(RTS)* 67(CTS)* 69(RI)* 70(DCD)* 72(DTR)* 83(COEX1)* 84(COEX2)* 86(COEX3)* 87(GPIO77)*; U10 13(MOUT)*; U12 C6(SIM_VPP)*

### Layout directives
differential pair; net class USBDIFF: USB_2_N, USB_2_P
net class ANT: AUX_ANT, AUX_FEED, GNSS_ANT, GNSS_FEED, MAIN_ANT, MAIN_FEED

### Notes on the sheet
- Size:
- Date:
- Sheet Name:
- A3
- Sheet
- Time:
- of
- Author :
- Hatim Saad
- Project:
- File:

### Library data of the parts
ANT3 ANT4 = SMA_1: Right Angled Female SMA Connector
ANT5 = APAE1575R2520ABDD7-T: 1575.42MHZ, 25*25*2mm GPS Patch Antenna; Manufacturer: Abracon; Supplier 1: Mouser; Manufacturer Part Number: APAE1575R2520ABDD7-T; RoHS: Yes; Category: RF Antennas; Stock 1: 803; Pricing 1: 1=1.7, 10=1.23, 50=1.23, 100=1.23, 1000=0.777, 10000=0.748 (USD); ComponentLink1URL: https://datasheet.ciiva.com/6491/apae1575r2520abdd7-t-6491907.pdf?src-supplier=Digi-Key; ComponentLink1Description: https://datasheet.ciiva.com/6491/apae1575r2520abdd7-t-6491907.pdf?src-supplier=Digi-Key; ComponentLink2URL: https://datasheet.ciiva.com/12398/apae1575r2520abdd7-t-218096-12398364.pdf?src-supplier=Mouser; ComponentLink2Description: https://datasheet.ciiva.com/12398/apae1575r2520abdd7-t-218096-12398364.pdf?src-supplier=Mouser; Supplier Part Number 1: 815-1575R2520ABDD7T
C18 C19 C24 C25 = 16TQC100MYF: Tantalum Polymer Capacitor, 100 uF, 16 V, ± 20%, D2, 50 mohm, 2917 [7343-19 Metric]; Manufacturer: Panasonic; Supplier 1: Mouser; Manufacturer Part Number: 16TQC100MYF; RoHS: Yes; Category: Polymer Capacitors; Stock 1: 5797; Pricing 1: 1=2.61, 10=2.17, 50=1.93, 100=1.73, 1000=1.38, 10000=1.23 (USD); ComponentLink1URL: https://datasheet.ciiva.com/48674/aaa8000ce14-48674997.pdf?src-supplier=Avnet; ComponentLink1Description: https://datasheet.ciiva.com/48674/aaa8000ce14-48674997.pdf?src-supplier=Avnet; ComponentLink2URL: https://datasheet.ciiva.com/25784/1734368-25784893.pdf?src-supplier=Farnell; ComponentLink2Description: https://datasheet.ciiva.com/25784/1734368-25784893.pdf?src-supplier=Farnell; ComponentLink3URL: https://datasheet.ciiva.com/22745/1734368-22745198.pdf?src-supplier=Element14; ComponentLink3Description: https://datasheet.ciiva.com/22745/1734368-22745198.pdf?src-supplier=Element14; Supplier Part Number 1: 667-16TQC100MYF
C20-C23 C27 C29 C30 C32 C33 C35 C37-C43 = CAP 0603: CAP SMD 0603
C26 = MPD471M0JD28009R: 4V 470uF ±20% SMD,4.3x7.3mm Solid Capacitors ROHS; ComponentLink1Description: LCSC; ComponentLink1URL: https://www.lcsc.com/product-detail/Solid-Capacitors_Ymin-MPD471M0JD28009R_C2997489.html
C28 C31 C34 C36 = CAP 0805: CAP SMD 0805
D1 D3 D8 = ESD5B5.0ST1G: ESD5B5.0S Series 5.8 V 50 W 32 pF SMT ESD Protection Diode - SOD-523; Manufacturer: ON Semiconductor; Supplier 1: Mouser; Manufacturer Part Number: ESD5B5.0ST1G; RoHS: Yes; Category: ESD and Circuit Protection ICs; Stock 1: 309834; Pricing 1: 1=0.27, 10=0.185, 50=0.185, 100=0.086, 1000=0.063, 10000=0.038 (USD); ComponentLink1URL: https://datasheet.ciiva.com/339/esd5b5-0st1g-339772.pdf?src-supplier=Digi-Key; ComponentLink1Description: https://datasheet.ciiva.com/339/esd5b5-0st1g-339772.pdf?src-supplier=Digi-Key; ComponentLink2URL: https://datasheet.ciiva.com/339/esd5b5-0st1g-339772.pdf?src-supplier=Avnet; ComponentLink2Description: https://datasheet.ciiva.com/339/esd5b5-0st1g-339772.pdf?src-supplier=Avnet; ComponentLink3URL: https://datasheet.ciiva.com/4510/esd5b5-0st1g-241623-4510548.pdf?src-supplier=Mouser; ComponentLink3Description: https://datasheet.ciiva.com/4510/esd5b5-0st1g-241623-4510548.pdf?src-supplier=Mouser; ComponentLink4URL: https://datasheet.ciiva.com/22637/716649-22637178.pdf?src-supplier=Element14; ComponentLink4Description: https://datasheet.ciiva.com/22637/716649-22637178.pdf?src-supplier=Element14; ComponentLink5URL: https://datasheet.ciiva.com/339/esd5b5-0st1-d-339773.pdf?src-supplier=Digi-Key; ComponentLink5Description: https://datasheet.ciiva.com/339/esd5b5-0st1-d-339773.pdf?src-supplier=Digi-Key; ComponentLink6URL: https://datasheet.ciiva.com/339/esd5b5-0st1-d-339774.pdf?src-supplier=Digi-Key; ComponentLink6Description: https://datasheet.ciiva.com/339/esd5b5-0st1-d-339774.pdf?src-supplier=Digi-Key; Supplier Part Number 1: 863-ESD5B50ST1G
D2 = LED BLUE 0603: LED BLUE CLEAR 0603 SMD
D4-D6 = ESD9L5.0ST5G: ESD Suppressor Diode TVS Uni-Dir 5V 9.8Vc 2-Pin SOD-923 T/R; Manufacturer: ON Semiconductor; Supplier 1: Mouser; Manufacturer Part Number: ESD9L5.0ST5G; RoHS: Yes; Category: ESD and Circuit Protection ICs; Pricing 1: 1=0.34, 10=0.245, 50=0.245, 100=0.097, 1000=0.066, 10000=0.05 (USD); ComponentLink1URL: https://datasheet.ciiva.com/15143/getdatasheetpartid-185186-15143896.pdf?src-supplier=Verical; ComponentLink1Description: https://datasheet.ciiva.com/15143/getdatasheetpartid-185186-15143896.pdf?src-supplier=Verical; ComponentLink2URL: https://datasheet.ciiva.com/339/esd9l-d-339853.pdf?src-supplier=Digi-Key; ComponentLink2Description: https://datasheet.ciiva.com/339/esd9l-d-339853.pdf?src-supplier=Digi-Key; ComponentLink3URL: https://datasheet.ciiva.com/339/esd9l-d-339854.pdf?src-supplier=Digi-Key; ComponentLink3Description: https://datasheet.ciiva.com/339/esd9l-d-339854.pdf?src-supplier=Digi-Key; ComponentLink4URL: https://datasheet.ciiva.com/339/esd9l-d-339855.pdf?src-supplier=Digi-Key; ComponentLink4Description: https://datasheet.ciiva.com/339/esd9l-d-339855.pdf?src-supplier=Digi-Key; ComponentLink5URL: https://datasheet.ciiva.com/3304/esd9l-d-3304011.pdf?src-supplier=Avnet; ComponentLink5Description: https://datasheet.ciiva.com/3304/esd9l-d-3304011.pdf?src-supplier=Avnet; ComponentLink6URL: https://datasheet.ciiva.com/11195/esd9l-d-11195342.pdf?src-supplier=Avnet; ComponentLink6Description: https://datasheet.ciiva.com/11195/esd9l-d-11195342.pdf?src-supplier=Avnet; ComponentLink7URL: https://datasheet.ciiva.com/16437/esd9l-d-16437835.pdf?src-supplier=Future+Electronics; ComponentLink7Description: https://datasheet.ciiva.com/16437/esd9l-d-16437835.pdf?src-supplier=Future+Electronics; Supplier Part Number 1: 863-ESD9L5.0ST5G
D7 = LED GREEN 0603: LED GREEN CLEAR 0603 SMD
J1 = CONN 2_HF
L3-L5 = IND 0603: IND SMD 0603
P1 = 12402012E212A: as P2 on sheet USB; Supplier: Mouser; Supplier Part Number: 523-12402012E212A; Manufacturer Part Number: 12402012E212A; RoHS: No; Category: Connectors; Stock: 14661; Pricing: 1=0.66, 10=0.523, 50=0.502, 100=0.46, 1000=0.345, 10000=0.293 (USD); Supplier 1: Mouser; Supplier Part Number 1: 523-12402012E212A
R8-R28 = RES 0603: RES SMD 0603
TP7 = test point: as TP1 on sheet Main; PartNumber: 5010; SymbolVersion: 2008-04-04; PackageReference: Red Multipurpose Testpoint; RoHS: Y; MountType: TH; ComponentLink1Description: Datasheet Link; ComponentLink1URL: http://www.keyelco.com/userAssets/file/M60-2p60.pdf; Value: Red; Publisher: Texas Instruments; LatestRevisionDate: 2015-08-25
U6 = SIM7600E-H: RF TXRX MODULE CELLULAR LTE SMD
U7-U9 U14 = MMBT2222A-7-F: as U1 on sheet ESP32; Supplier 1: Mouser; Manufacturer Part Number: MMBT2222A-7-F; RoHS: Yes; Category: BJTs; Stock 1: 1332144; Pricing 1: 1=0.14, 10=0.097, 50=0.097, 100=0.041, 1000=0.028, 10000=0.016 (USD); Mount: Surface Mount; Case/Package: SOT-23; Number of Pins: 3; Weight: 0.000282oz; Min Operating Temperature: -55°C; Max Operating Temperature: 150°C; Polarity: NPN; Packaging: Tape and Reel; Package Quantity: 3000; Continuous Collector Current: 600mA; Collector Emitter Breakdown Voltage: 40V; Transition Frequency: 300MHz; Max Breakdown Voltage: 40V; Max Frequency: 300MHz; Termination: SMD/SMT; Gain Bandwidth Product: 300MHz; Voltage Rating (DC): 40V; Current Rating: 600mA; Voltage: 40V; Collector-emitter Voltage-Max: 1V; Series: Automotive, AEC-Q101; Length: 3.05mm; Width: 1.4mm; Height: 1mm; Radiation Hardening: No; Reach SVHC Compliant: No; Lead Free: Lead Free; RoHS Compliant: Yes; ComponentLink1URL: https://datasheet.ciiva.com/15139/getdatasheetpartid-82692-15139078.pdf?src-supplier=Verical; ComponentLink1Description: https://datasheet.ciiva.com/15139/getdatasheetpartid-82692-15139078.pdf?src-supplier=Verical; ComponentLink2URL: https://datasheet.ciiva.com/8029/ds30041-8029709.pdf?src-supplier=Element14; ComponentLink2Description: https://datasheet.ciiva.com/8029/ds30041-8029709.pdf?src-supplier=Element14; ComponentLink3URL: https://datasheet.ciiva.com/11201/ds30041-11201864.pdf?src-supplier=Avnet; ComponentLink3Description: https://datasheet.ciiva.com/11201/ds30041-11201864.pdf?src-supplier=Avnet; ComponentLink4URL: https://datasheet.ciiva.com/16199/ds30041-16199045.pdf?src-supplier=Future+Electronics; ComponentLink4Description: https://datasheet.ciiva.com/16199/ds30041-16199045.pdf?src-supplier=Future+Electronics; ComponentLink5URL: https://datasheet.ciiva.com/11198/ds30041-11198965.pdf?src-supplier=Avnet; ComponentLink5Description: https://datasheet.ciiva.com/11198/ds30041-11198965.pdf?src-supplier=Avnet; ComponentLink6URL: https://datasheet.ciiva.com/972/ds30041-972551.pdf?src-supplier=Digi-Key; ComponentLink6Description: https://datasheet.ciiva.com/972/ds30041-972551.pdf?src-supplier=Digi-Key; ComponentLink7URL: https://datasheet.ciiva.com/972/ds30041-972552.pdf?src-supplier=Digi-Key; ComponentLink7Description: https://datasheet.ciiva.com/972/ds30041-972552.pdf?src-supplier=Digi-Key; ComponentLink8URL: https://datasheet.ciiva.com/972/ds30041-972550.pdf?src-supplier=Digi-Key; ComponentLink8Description: https://datasheet.ciiva.com/972/ds30041-972550.pdf?src-supplier=Digi-Key; Supplier Part Number 1: 621-MMBT2222A-F
U10 = NAU8810YG: IC Audio Codec Mono 20QFN; Manufacturer: Nuvoton; Resolution: 24b; Supplier: Digi-Key; Supplier Part Number: NAU8810YG-ND; Manufacturer Part Number: NAU8810YG; RoHS: No; Category: Integrated Circuits (ICs); Stock: 27148; Pricing: 1=2.56, 10=2.302, 25=2.1716, 80=1.85013, 230=1.73722, 490=1.52004, 980=1.25947, 2450=1.17261, 4900=1.12918 (USD); Mounting Technology: Surface Mount; Case/Package: QFN; Min Operating Temperature: -40°C; Max Operating Temperature: 85°C; Packaging: Tray; Series: emPowerAudio™; ComponentLink1URL: https://datasheet.ciiva.com/18624/nau8810-datasheet-rev-1-2-18624999.pdf?src-supplier=Digi-Key; ComponentLink1Description: https://datasheet.ciiva.com/18624/nau8810-datasheet-rev-1-2-18624999.pdf?src-supplier=Digi-Key; Supplier 1: Digi-Key; Supplier Part Number 1: NAU8810YG-ND
U11 = C390998: NanoSIM tray SIM Card Connectors; Publisher: Bastam Beyrami; ComponentLink1Description: LCSC; ComponentLink1URL: https://lcsc.com/product-detail/SIM-Card-Connectors_XUNPU-SMN-327-KT1_C390998.html
U12 = C390997: NanoSIM SMD SIM Card Connectors; Publisher: Bastam Beyrami; ComponentLink1Description: LCSC; ComponentLink1URL: https://lcsc.com/product-detail/SIM-Card-Connectors_XUNPU-SMN-327_C390997.html
U13 = ESDA6V1W5: ESDA Series 4 Channel 6.1V 90 pF SMT Uni-Directional Transil Array - SOT-323-5L; Manufacturer: STMicroelectronics; Direction: Unidirectional; Number of Elements: 4; Value: 90pF; Operating Supply Voltage: 3V; Breakdown Voltage: 7.2V; Peak Pulse Power: 150W; Power Line Protection: No; Leakage Current: 1uA; Test Current: 1mA; ESD Protection: Yes; Peak Pulse Current: 15A; Diode Type: ZENER; Supplier: Mouser; Supplier Part Number: 511-ESDA6V1W5; Manufacturer Part Number: ESDA6V1W5; RoHS: Yes; Category: TVS Diodes; Stock: 3674; Pricing: 1=0.43, 10=0.362, 50=0.362, 100=0.285, 1000=0.178, 10000=0.125 (USD); Mounting Technology: Surface Mount; Case/Package: SOT-323; Pins: 5; Min Operating Temperature: -40°C; Max Operating Temperature: 125°C; Packaging: Tape and Reel; Reverse Breakdown Voltage: 6.1V; Package Quantity: 1; Polarity: Unidirectional; Number of Channels: 4; Termination: SMD/SMT; Number of Unidirectional Channels: 4; Reverse Standoff Voltage: 3V; Min Breakdown Voltage: 6.1V; Working Voltage: 3V; Max Reverse Leakage Current: 1uA; Max Breakdown Voltage: 7.2V; Voltage Rating (DC): 6.1V; Series: ESDA, TRANSIL™; Length: 2.2mm; Width: 1.35mm; Height: 1mm; Depth: 1.35mm; Radiation Hardening: No; Reach SVHC Compliant: No; Lead Free: Lead Free; RoHS Compliant: Yes; ComponentLink1URL: https://datasheet.ciiva.com/15143/getdatasheetpartid-134557-15143650.pdf?src-supplier=Verical; ComponentLink1Description: https://datasheet.ciiva.com/15143/getdatasheetpartid-134557-15143650.pdf?src-supplier=Verical; ComponentLink2URL: https://datasheet.ciiva.com/1276/1671027-1276908.pdf?src-supplier=Element14; ComponentLink2Description: https://datasheet.ciiva.com/1276/1671027-1276908.pdf?src-supplier=Element14; ComponentLink3URL: https://datasheet.ciiva.com/22695/1671027-22695673.pdf?src-supplier=Element14; ComponentLink3Description: https://datasheet.ciiva.com/22695/1671027-22695673.pdf?src-supplier=Element14; ComponentLink4URL: https://datasheet.ciiva.com/338/cd00064033-338380.pdf?src-supplier=Digi-Key; ComponentLink4Description: https://datasheet.ciiva.com/338/cd00064033-338380.pdf?src-supplier=Digi-Key; ComponentLink5URL: https://datasheet.ciiva.com/338/cd00064033-338379.pdf?src-supplier=Digi-Key; ComponentLink5Description: https://datasheet.ciiva.com/338/cd00064033-338379.pdf?src-supplier=Digi-Key; ComponentLink6URL: https://datasheet.ciiva.com/338/cd00064033-338381.pdf?src-supplier=Digi-Key; ComponentLink6Description: https://datasheet.ciiva.com/338/cd00064033-338381.pdf?src-supplier=Digi-Key; ComponentLink7URL: https://datasheet.ciiva.com/41443/001184222-da-01-en-transil-array-da-esda6v1w5-sot-323-5-stm-41443642.pdf?src-supplier=Conrad; ComponentLink7Description: https://datasheet.ciiva.com/41443/001184222-da-01-en-transil-array-da-esda6v1w5-sot-323-5-stm-41443642.pdf?src-supplier=Conrad; Supplier 1: Mouser; Supplier Part Number 1: 511-ESDA6V1W5

## Sheet Speaker.SchDoc
size A4; DocumentNumber: 7; SheetNumber: 7; SheetTotal: 8
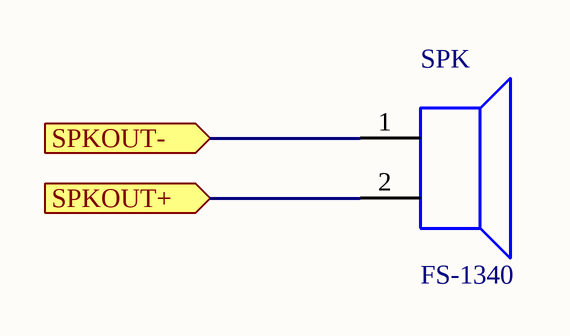
[diagram p5: Speaker.SchDoc]

### Parts
SPK  FS-1340  [SPKR_SMS-1508MS-HT-R]

### Ports
SPKOUT+ (in), SPKOUT- (in)

### Nets
NetSPK_1: SPK.1(+) ; port SPKOUT-
NetSPK_2: SPK.2(-) ; port SPKOUT+

### Notes on the sheet
- Size:
- Date:
- Sheet Name:
- A4
- Sheet
- Time:
- of
- Author :
- Hatim Saad
- Project:
- File:

### Library data of the parts
SPK = FS-1340: Speakers ROHS; ComponentLink1Description: LCSC; ComponentLink1URL: https://www.lcsc.com/product-detail/Speakers_FUET-FS-1340_C482342.html

## Sheet Power.SchDoc
size A4; DocumentNumber: 2; SheetNumber: 2; SheetTotal: 8
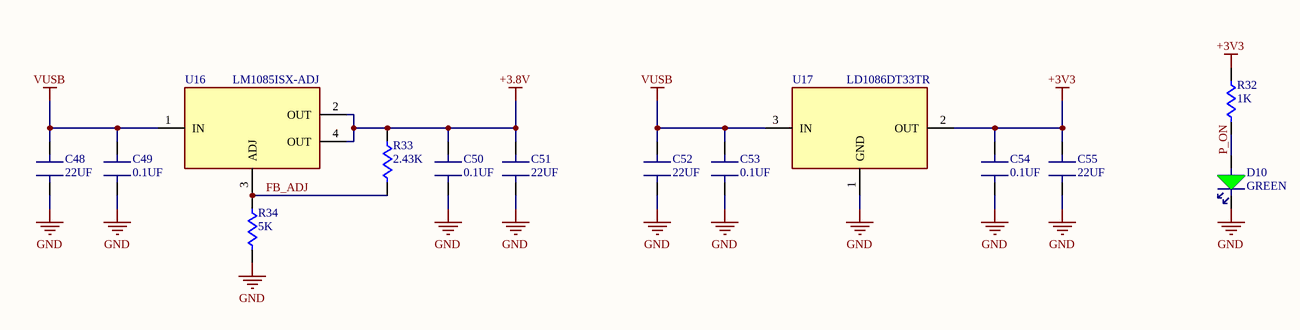
[diagram p6: Power.SchDoc]

### Parts
C48  22UF  [CAP: 1206]
C49  0.1UF  [CAP: 0603]
C50  0.1UF  [CAP: 0603]
C51  22UF  [CAP: 1206]
C52  22UF  [CAP: 1206]
C53  0.1UF  [CAP: 0603]
C54  0.1UF  [CAP: 0603]
C55  22UF  [CAP: 1206]
D10  GREEN  [LED: 0603G]
R32  1K  [RES: 0603]
R33  2.43K  [RES: 0603]
R34  5K  [RES: 0603]
U16  LM1085ISX-ADJ  [TO263-3]
U17  LD1086DT33TR  [DPAK]

### Nets
+3.8V: C50.1(A) C51.2(B) R33.2 U16.2(OUT) U16.4(OUT)
+3V3: C54.1(A) C55.2(B) R32.2 U17.2(OUT)
GND: C48.1(A) C49.2(B) C50.2(B) C51.1(A) C52.1(A) C53.2(B) C54.2(B) C55.1(A) D10.1(C) R34.2 U17.1(GND)
VUSB: C48.2(B) C49.1(A) C52.2(B) C53.1(A) U16.1(IN) U17.3(IN)
FB_ADJ: R33.1 R34.1 U16.3(ADJ)
P_ON: D10.2(A) R32.1

### Notes on the sheet
- Size:
- Date:
- Sheet Name:
- A4
- Sheet
- Time:
- of
- Author :
- Hatim Saad
- Project:
- File:

### Library data of the parts
C48 C51 C52 C55 = CAP 1206: CAP SMD 1206
C49 C50 C53 C54 = CAP 0603: CAP SMD 0603
D10 = LED GREEN 0603: LED GREEN CLEAR 0603 SMD
R32-R34 = RES 0603: RES SMD 0603
U16 = LM1085ISX-ADJ/NOPB: 3-A, 29-V, linear voltage regulator 3-DDPAK/TO-263 -40 to 125; Manufacturer: TI National Semiconductor; Supplier: Mouser; Supplier Part Number: 926-LM1085ISXADJNOPB; Manufacturer Part Number: LM1085ISX-ADJ/NOPB; RoHS: Yes; Category: Voltage Regulators - Linear; Stock: 9505; Pricing: 1=2.08, 10=1.83, 50=1.83, 100=1.47, 1000=1.02, 10000=0.896 (USD); ComponentLink1URL: https://datasheet.ciiva.com/6582/lm1085-6582736.pdf?src-supplier=Digi-Key; ComponentLink1Description: https://datasheet.ciiva.com/6582/lm1085-6582736.pdf?src-supplier=Digi-Key; ComponentLink2URL: https://datasheet.ciiva.com/41457/001013601-da-01-en-ic-reg-l-lm1085isx-adj-nopb-to-263-3-tid-41457358.pdf?src-supplier=Conrad; ComponentLink2Description: https://datasheet.ciiva.com/41457/001013601-da-01-en-ic-reg-l-lm1085isx-adj-nopb-to-263-3-tid-41457358.pdf?src-supplier=Conrad; Supplier 1: Mouser; Supplier Part Number 1: 926-LM1085ISXADJNOPB
U17 = LD1086DT33TR: IC REG LDO 3.3V 1.5A DPAK; Manufacturer: STMicroelectronics; Number of Outputs: 1; Max Supply Voltage: 30V; Dropout Voltage: 1.3V; Polarity: Positive; Quiescent Current: 10mA; Accuracy: 1%; Output Type: Fixed; Min Input Voltage: 6.3V; Input Bias Current: 5mA; Supplier: Mouser; Supplier Part Number: 511-LD1086DT33-TR; Manufacturer Part Number: LD1086DT33TR; RoHS: Yes; Category: Voltage Regulators - Linear; Stock: 228; Pricing: 1=1.61, 10=1.44, 50=1.35, 100=1.13, 1000=0.733, 10000=0.687 (USD); Mounting Technology: Surface Mount; Case/Package: TO-252; Pins: 3; Min Operating Temperature: -40°C; Max Operating Temperature: 125°C; Output Voltage: 3.3V; Packaging: Cut Tape; Max Output current: 1.5A; Output Current: 1.5A; Package Quantity: 1; Series: -; Nominal Output Voltage: 3.3V; Number of Regulators: 1; Min Output Voltage: 3.3V; Length: 6.6mm; Width: 6.2mm; Height: 2.4mm; Radiation Hardening: No; Reach SVHC Compliant: No; Lead Free: Lead Free; RoHS Compliant: Yes; ComponentLink1URL: https://datasheet.ciiva.com/1511/1880971-1511550.pdf?src-supplier=Element14; ComponentLink1Description: https://datasheet.ciiva.com/1511/1880971-1511550.pdf?src-supplier=Element14; ComponentLink2URL: https://datasheet.ciiva.com/1511/1880971-1511549.pdf?src-supplier=Element14; ComponentLink2Description: https://datasheet.ciiva.com/1511/1880971-1511549.pdf?src-supplier=Element14; ComponentLink3URL: https://datasheet.ciiva.com/2043/cd00001884-2043961.pdf?src-supplier=Digi-Key; ComponentLink3Description: https://datasheet.ciiva.com/2043/cd00001884-2043961.pdf?src-supplier=Digi-Key; ComponentLink4URL: https://datasheet.ciiva.com/2043/cd00001884-2043960.pdf?src-supplier=Digi-Key; ComponentLink4Description: https://datasheet.ciiva.com/2043/cd00001884-2043960.pdf?src-supplier=Digi-Key; ComponentLink5URL: https://datasheet.ciiva.com/2043/cd00001884-2043962.pdf?src-supplier=Digi-Key; ComponentLink5Description: https://datasheet.ciiva.com/2043/cd00001884-2043962.pdf?src-supplier=Digi-Key; ComponentLink6URL: https://datasheet.ciiva.com/3225/cd00001884-3225081.pdf?src-supplier=Avnet; ComponentLink6Description: https://datasheet.ciiva.com/3225/cd00001884-3225081.pdf?src-supplier=Avnet; ComponentLink7URL: https://datasheet.ciiva.com/16496/cd00001884-16496030.pdf?src-supplier=Future+Electronics; ComponentLink7Description: https://datasheet.ciiva.com/16496/cd00001884-16496030.pdf?src-supplier=Future+Electronics; Supplier 1: Mouser; Supplier Part Number 1: 511-LD1086DT33-TR

## Sheet Level Shifter.SchDoc
size A4; DocumentNumber: 6; SheetNumber: 6; SheetTotal: 8
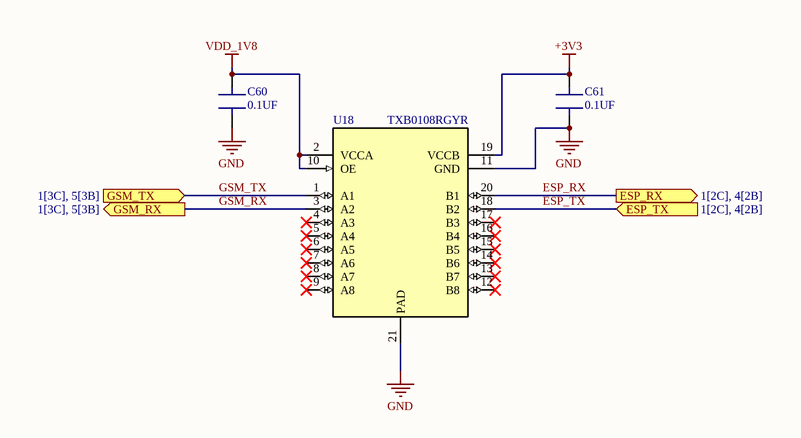
[diagram p7: Level Shifter.SchDoc]

### Parts
C60  0.1UF  [CAP: 0603]
C61  0.1UF  [CAP: 0603]
U18  TXB0108RGYR  [20-VQFN (3.5x4.5)]

### Ports
ESP_RX (out, see 1[2C], 4[2B]), ESP_TX (in, see 1[2C], 4[2B]), GSM_RX (out, see 1[3C], 5[3B]), GSM_TX (in, see 1[3C], 5[3B])

### Nets
+3V3: C61.1(A) U18.19(VCCB)
GND: C60.2(B) C61.2(B) U18.11(GND) U18.21(PAD)
VDD_1V8: C60.1(A) U18.2(VCCA) U18.10(OE)
ESP_RX: U18.20(B1) ; port ESP_RX
ESP_TX: U18.18(B2) ; port ESP_TX
GSM_RX: U18.3(A2) ; port GSM_RX
GSM_TX: U18.1(A1) ; port GSM_TX

Not connected (* = marked no-connect by the designer): U18 4(A3)* 5(A4)* 6(A5)* 7(A6)* 8(A7)* 9(A8)* 12(B8)* 13(B7)* 14(B6)* 15(B5)* 16(B4)* 17(B3)*

### Notes on the sheet
- Size:
- Date:
- Sheet Name:
- A4
- Sheet
- Time:
- of
- Author :
- Hatim Saad
- Project:
- File:

### Library data of the parts
C60 C61 = CAP 0603: CAP SMD 0603
U18 = TXB0108RGYR: IC 8-BIT TRNSLTR 15KV ESD 20VQFN; Manufacturer: Texas Instruments; Supplier 1: Mouser; Manufacturer Part Number: TXB0108RGYR; RoHS: Yes; Category: Voltage Level Shifters; Stock 1: 27868; Pricing 1: 1=1.54, 10=1.32, 50=1.32, 100=1.12, 1000=0.763, 10000=0.671 (USD); ComponentLink1URL: https://datasheet.ciiva.com/15096/getdatasheetpartid-172984-15096214.pdf?src-supplier=Verical; ComponentLink1Description: https://datasheet.ciiva.com/15096/getdatasheetpartid-172984-15096214.pdf?src-supplier=Verical; ComponentLink2URL: https://datasheet.ciiva.com/1899/txb0108-1899601.pdf?src-supplier=Digi-Key; ComponentLink2Description: https://datasheet.ciiva.com/1899/txb0108-1899601.pdf?src-supplier=Digi-Key; ComponentLink3URL: https://datasheet.ciiva.com/1899/txb0108-1899602.pdf?src-supplier=Digi-Key; ComponentLink3Description: https://datasheet.ciiva.com/1899/txb0108-1899602.pdf?src-supplier=Digi-Key; ComponentLink4URL: https://datasheet.ciiva.com/1899/txb0108-1899603.pdf?src-supplier=Digi-Key; ComponentLink4Description: https://datasheet.ciiva.com/1899/txb0108-1899603.pdf?src-supplier=Digi-Key; ComponentLink5URL: https://datasheet.ciiva.com/1508/1811182-1508728.pdf?src-supplier=Element14; ComponentLink5Description: https://datasheet.ciiva.com/1508/1811182-1508728.pdf?src-supplier=Element14; Supplier Part Number 1: 595-TXB0108RGYR

## Nets that join several sheets
+3.8V: Main (TP3.1), GPRS_GNSS (18 pins), Power (5 pins)
+3V3: Main (TP4.1), ESP32 (16 pins), GPRS_GNSS (C30.1 C31.2 R25.2 U10.2), Power (C54.1 C55.2 R32.2 U17.2), Level Shifter (C61.1 U18.19)
GND: Main (MH1.1 MH2.1 MH3.1 MH4.1), ESP32 (27 pins), Microphone (C56.2 C57.1 R36.1), USB (15 pins), GPRS_GNSS (76 pins), Power (11 pins), Level Shifter (C60.2 C61.2 U18.11 U18.21)
VDD_1V8: Main (TP5.1), GPRS_GNSS (7 pins), Level Shifter (C60.1 U18.2 U18.10)
VDD_SPI: Main (TP6.1), ESP32 (C9.1 C12.1 U3.18 U4.8)
VUSB: Main (TP1.1), USB (8 pins), Power (6 pins)
VUSB_2: Main (TP2.1), GPRS_GNSS (D6.1 P1.A4_B9 P1.B4_A9 U6.11)
DTR: ESP32 (R5.2 U1.2), USB (U15.28)
ESP_RX: ESP32 (U3.26), Level Shifter (U18.20)
ESP_TX: ESP32 (U3.25), Level Shifter (U18.18)
GSM_RX: GPRS_GNSS (U6.68), Level Shifter (U18.3)
GSM_TX: GPRS_GNSS (U6.71), Level Shifter (U18.1)
GSMRES_1: ESP32 (U3.8), GPRS_GNSS (R12.1)
MIC+: Microphone (C58.2), GPRS_GNSS (U10.20)
MIC-: Microphone (C59.2), GPRS_GNSS (U10.19)
MICBIAS: Microphone (C56.1 C57.2 R35.2), GPRS_GNSS (U10.1)
NetSPK_1: GPRS_GNSS (U10.16), Speaker (SPK.1)
NetSPK_2: GPRS_GNSS (U10.14), Speaker (SPK.2)
PWRKEY_1: ESP32 (U3.16), GPRS_GNSS (R8.1)
RTS: ESP32 (R4.2 U2.2), USB (U15.24)
USB_RXD: ESP32 (R7.2), USB (U15.25)
USB_TXD: ESP32 (U3.27), USB (U15.26)